# Altium project Gateway PCB.PrjPcb
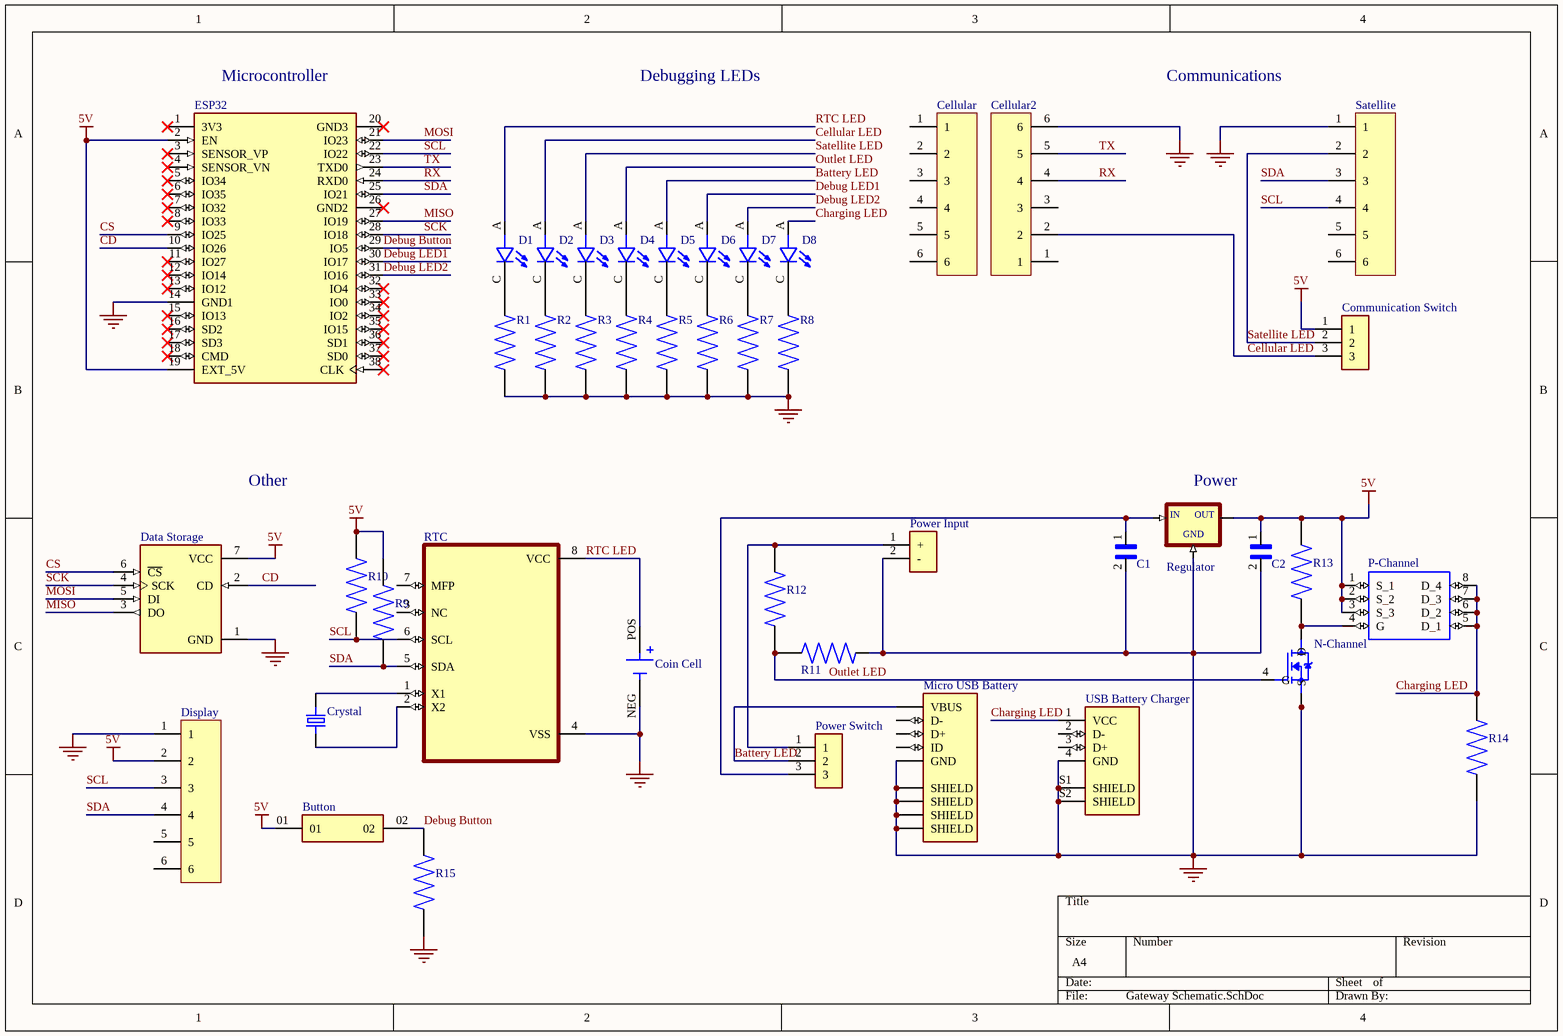
[diagram p0: Gateway Schematic.SchDoc]
1 sheet, 43 parts. Net scope: global (net labels, ports and power ports of the same name join across sheets).
Board file: Gateway Board.PcbDoc

## Sheet Gateway Schematic.SchDoc
size A4; SheetNumber: 1; SheetTotal: 1

### Parts
Button  TSW-101-23-T-D  [SAMTEC_TSW-101-23-T-D]  (value not drawn)
C1  CC0603JRX7R9BB101  [CAPC1608X90]  (value not drawn)
C2  CC0603JRX7R9BB331  [CAPC1608X90]  (value not drawn)
Cellular  1x6 Header  [Header6x2]  (value not drawn)
Cellular2  1x6 Header  [Header6x2]  (value not drawn)
Coin_Cell  BH2430T-C  [BAT_BH2430T-C]  (value not drawn)
Communication_Switch  282837-3  [TE_282837-3]  (value not drawn)
Crystal  ECS-.327-8-14X  [XTAL_ECS-.327-8-14X]  (value not drawn)
D1  SML-D12D1WT86  [LED_SML-D12D1WT86]  (value not drawn)
D2  SML-D12FWT86  [LED_SML-D12FWT86]  (value not drawn)
D3  SML-D12FWT86  [LED_SML-D12FWT86]  (value not drawn)
D4  SML-D12U1WT86  [LED_SML-D12Y1WT86]  (value not drawn)
D5  SML-D12U1WT86  [LED_SML-D12Y1WT86]  (value not drawn)
D6  SML-D12Y1WT86  [LED_SML-D12Y1WT86]  (value not drawn)
D7  SML-D12Y1WT86  [LED_SML-D12Y1WT86]  (value not drawn)
D8  SML-D12D1WT86  [LED_SML-D12D1WT86]  (value not drawn)
Data_Storage  DEV-13743  [MODULE_DEV-13743]  (value not drawn)
Display  1x6 Header  [Header6x2]  (value not drawn)
ESP32  ESP32-DEVKITC-32D  [MODULE_ESP32-DEVKITC-32D]  (value not drawn)
Micro_USB_Battery  USB3100-XX-X_REVB  [GCT_USB3100-XX-X_REVB]  (value not drawn)
N-Channel  FDS2734  [SOIC127P600X175-8N]  (value not drawn)
P-Channel  FDS6575  [SOIC127P600X175-8N]  (value not drawn)
Power_Input  282837-2  [TE_282837-2]  (value not drawn)
Power_Switch  282837-3  [TE_282837-3]  (value not drawn)
R1  RT0603BRD0743RL  [RESC1608X55N]  (value not drawn)
R2  RT0603FRE07140RL  [RESC1608X55N]  (value not drawn)
R3  RT0603FRE07140RL  [RESC1608X55N]  (value not drawn)
R4  RT0603DRE07196RL  [RESC1608X55N]  (value not drawn)
R5  RT0603FRE07140RL  [RESC1608X55N]  (value not drawn)
R6  RT0603FRE07140RL  [RESC1608X55N]  (value not drawn)
R7  RT0603FRE07140RL  [RESC1608X55N]  (value not drawn)
R8  RT0603FRE07140RL  [RESC1608X55N]  (value not drawn)
R9  RT0603FRD0711KL  [RESC1608X55N]  (value not drawn)
R10  RT0603FRD0711KL  [RESC1608X55N]  (value not drawn)
R11  RT0603FRD0711KL  [RESC1608X55N]  (value not drawn)
R12  RT0603FRD0711KL  [RESC1608X55N]  (value not drawn)
R13  RT0603FRD0711KL  [RESC1608X55N]  (value not drawn)
R14  RT0603FRD0711KL  [RESC1608X55N]  (value not drawn)
R15  RT0603FRD0711KL  [RESC1608X55N]  (value not drawn)
Regulator  L78S05CV  [TO-220-STANDING]  (value not drawn)
RTC  MCP7940M-I/P  [DIP787W46P254L927H533Q8]  (value not drawn)
Satellite  1x6 Header  [Header6x2]  (value not drawn)
USB_Battery_Charger  USB1130-15-A_REVA  [GCT_USB1130-15-A_REVA]  (value not drawn)

### Nets
5V: Button.01 C2.1 Communication_Switch.1 Data_Storage.7(VCC) Display.2 ESP32.2(EN) ESP32.19(EXT_5V) P-Channel.1(S_1) P-Channel.2(S_2) P-Channel.3(S_3) R9.2 R10.2 R13.2 Regulator.3(OUT)
GND: C1.2 C2.2 Cellular2.6 Coin_Cell.NEG Data_Storage.1(GND) Display.1 ESP32.14(GND1) Micro_USB_Battery.5(GND) Micro_USB_Battery.6(SHIELD) Micro_USB_Battery.7(SHIELD) Micro_USB_Battery.8(SHIELD) Micro_USB_Battery.9(SHIELD) N-Channel.1(S) N-Channel.2(S) N-Channel.3(S) Power_Input.2(-) R1.1 R2.1 R3.1 R4.1 R5.1 R6.1 R7.1 R8.1 R11.2 R14.1 R15.1 Regulator.2(GND) RTC.4(VSS) Satellite.1 USB_Battery_Charger.4(GND) USB_Battery_Charger.S1(SHIELD) USB_Battery_Charger.S2(SHIELD)
Battery LED: D5.A Micro_USB_Battery.1(VBUS) Power_Switch.2
CD: Data_Storage.2(CD) ESP32.10(IO26)
Cellular LED: Cellular2.2 Communication_Switch.3 D2.A
Charging LED: D8.A P-Channel.5(D_1) P-Channel.6(D_2) P-Channel.7(D_3) P-Channel.8(D_4) R14.2 USB_Battery_Charger.1(VCC)
CS: Data_Storage.6(~{CS}) ESP32.9(IO25)
Debug Button: Button.02 ESP32.29(IO5) R15.2
Debug LED1: D6.A ESP32.30(IO17)
Debug LED2: D7.A ESP32.31(IO16)
MISO: Data_Storage.3(DO) ESP32.27(IO19)
MOSI: Data_Storage.5(DI) ESP32.21(IO23)
Outlet LED: D4.A N-Channel.4(G) R11.1 R12.1
RTC LED: Coin_Cell.POS D1.A RTC.8(VCC)
RX: Cellular2.4 ESP32.24(RXD0)
Satellite LED: Communication_Switch.2 D3.A Satellite.2
SCK: Data_Storage.4(SCK) ESP32.28(IO18)
SCL: Display.3 ESP32.22(IO22) R10.1 RTC.6(SCL) Satellite.4
SDA: Display.4 ESP32.25(IO21) R9.1 RTC.5(SDA) Satellite.3
TX: Cellular2.5 ESP32.23(TXD0)
NetC1_1: C1.1 Power_Switch.3 Regulator.1(IN)
NetCrystal_1: Crystal.1 RTC.2(X2)
NetCrystal_2: Crystal.2 RTC.1(X1)
NetD1_C: D1.C R1.2
NetD2_C: D2.C R2.2
NetD3_C: D3.C R3.2
NetD4_C: D4.C R4.2
NetD5_C: D5.C R5.2
NetD6_C: D6.C R6.2
NetD7_C: D7.C R7.2
NetD8_C: D8.C R8.2
NetN-Channel_5: N-Channel.5(D) N-Channel.6(D) N-Channel.7(D) N-Channel.8(D) P-Channel.4(G) R13.1
NetPower_Input_1: Power_Input.1(+) Power_Switch.1 R12.2

Not connected (* = marked no-connect by the designer): Cellular 1 2 3 4 5 6; Cellular2 1 3; Display 5 6; ESP32 1(3V3)* 3(SENSOR_VP)* 4(SENSOR_VN)* 5(IO34)* 6(IO35)* 7(IO32)* 8(IO33)* 11(IO27)* 12(IO14)* 13(IO12)* 15(IO13)* 16(SD2)* 17(SD3)* 18(CMD)* 20(GND3)* 26(GND2)* 32(IO4)* 33(IO0)* 34(IO2)* 35(IO15)* 36(SD1)* 37(SD0)* 38(CLK)*; Micro_USB_Battery 2(D-) 3(D+) 4(ID); RTC 3(NC) 7(MFP); Satellite 5 6; USB_Battery_Charger 2(D-) 3(D+)

### Notes on the sheet
- (near ESP32) Microcontroller
- Debugging LEDs
- Communications
- Other
- (near Regulator) Power

### Library data of the parts
Button = TSW-101-23-T-D: TSW Series .100 Terminal Strip; MF: Samtec; Package: None; MP: TSW-101-23-T-D; Price: None; Availability: Bad; Value: *; SnapEDA_Link: https://www.snapeda.com/parts/TSW-101-23-T-D/Samtec/view-part/3473100/?ref=snap
C1 = CC0603JRX7R9BB101: CAP CER 100PF 50V X7R 0603; Package: None; Price: None; Value: *; MP: CC0603JRX7R9BB101; Availability: Unavailable
C2 = CC0603JRX7R9BB331: Cap Ceramic 330pF 50VDC X7R 5% SMD 0603 125Â°C Paper T/R; Package: None; Price: None; Value: *; MP: CC0603JRX7R9BB331; Availability: Unavailable
Cellular Cellular2 Display Satellite = PPTC061LFBN-RC: Female, 6 C, Straight, .100"CC; 3.20mm Tail, No Mt. 100u" Tin; PBT, Phos Bronze, 105 C; Manufacturer: Sullins; Number of Positions: 6; Pitch: 0.1inch; Supplier 1: Digi-Key; Manufacturer Part Number: PPTC061LFBN-RC; RoHS: Yes; Category: Connectors; Stock 1: 78228; Pricing 1: 1=0.52000, 10=0.44900, 80=0.37050, 440=0.32220, 1000=0.26582, 5000=0.23360, 10000=0.23270 (USD); Mount: Through Hole; Color: Black; Contact Plating: Tin; Contact Material: Bronze; Housing Material: Plastic; Package Quantity: 1000; Number of Rows: 1; Packaging: Bulk; Termination: Solder; Connector Type: Header; Contact Type: Female Socket; Length: 15.7mm; Width: 2.5mm; Height: 8.5mm; Lead Free: Lead Free; RoHS Compliant: Yes; ComponentLink1URL: https://media.digikey.com/pdf/Data%20Sheets/Sullins%20PDFs/Female_Headers.100_DS.pdf?src-supplier=Digi-Key; ComponentLink1Description: https://media.digikey.com/pdf/Data%20Sheets/Sullins%20PDFs/Female_Headers.100_DS.pdf?src-supplier=Digi-Key; ComponentLink2URL: http://www.sullinscorp.com/catalogs/78_Page80-81_HEADER_.100_2.54mm_FEMALE.pdf?src-supplier=Future+Electronics; ComponentLink2Description: http://www.sullinscorp.com/catalogs/78_Page80-81_HEADER_.100_2.54mm_FEMALE.pdf?src-supplier=Future+Electronics; Supplier Part Number 1: S7004-ND
Coin_Cell = BH2430T-C: BATTERY HOLDER COIN PC PIN 24.5mm; MF: MPD; Price: None; MP: BH2430T-C; SnapEDA_Link: https://www.snapeda.com/parts/BH2430T-C/MPD/view-part/4389108/?ref=snap; Package: None; Availability: Unavailable; Value: *
Communication_Switch Power_Switch = 282837-3: Wire to Board 3 Position 5.08 mm Pitch 30-16 AWG Euro Style Terminal Block; MF: TE Connectivity; Check_prices: https://www.snapeda.com/parts/282837-3/TE%20Connectivity%20AMP%20Connectors/view-part/2765182/?ref=eda; SnapEDA_Link: https://www.snapeda.com/parts/282837-3/TE%20Connectivity%20AMP%20Connectors/view-part/2765182/?ref=snap; Availability: Good; MP: 282837-3; Purchase-URL: https://pricing.snapeda.com/search/part/282837-3/?ref=eda; Package: None; Price: None; Value: *
Crystal = ECS-.327-8-14X: 32.768kHz Â±20ppm Crystal 8pF 40 kOhms Cylindrical Can, Radial; MF: ECS Inc.; Arrow_Electronics-Purchase-URL: https://snapeda.com/shop?store=Arrow+Electronics&id=2180365; Price: None; DigiKey-Purchase-URL: https://snapeda.com/shop?store=DigiKey&id=2180365; Package: Cylindrical Can Radial  ECS International; Availability: Good; Value: *; Mouser-Purchase-URL: https://snapeda.com/shop?store=Mouser&id=2180365; MP: ECS-.327-8-14X; SnapEDA_Link: https://www.snapeda.com/parts/ECS-.327-8-14X/ECS%20Inc./view-part/2180365/?ref=snap
D1 D8 = SML-D12D1WT86: Orange 605nm LED Indication - Discrete 2.2V 0603 (1608 Metric); MF: Rohm; Price: None; Value: *; Package: 0603 Rohm; Purchase-URL: https://pricing.snapeda.com/search/part/SML-D12D1WT86/?ref=eda; SnapEDA_Link: https://www.snapeda.com/parts/SML-D12D1WT86/Rohm/view-part/681299/?ref=snap; MP: SML-D12D1WT86; Availability: Good; Check_prices: https://www.snapeda.com/parts/SML-D12D1WT86/Rohm/view-part/681299/?ref=eda
D2 D3 = SML-D12FWT86: Green 565nm LED Indication - Discrete 2.2V 0603 (1608 Metric); MF: Rohm; Check_prices: https://www.snapeda.com/parts/SML-D12FWT86/Rohm/view-part/2753923/?ref=eda; Package: 0603 Rohm; Price: None; Value: *; MP: SML-D12FWT86; SnapEDA_Link: https://www.snapeda.com/parts/SML-D12FWT86/Rohm/view-part/2753923/?ref=snap; Availability: Good; Purchase-URL: https://pricing.snapeda.com/search/part/SML-D12FWT86/?ref=eda
D4 D5 = SML-D12U1WT86: Red 620nm LED Indication - Discrete 2.2V 0603 _1608 Metric_; MF: Rohm; Package: 0603 Rohm; Price: None; MP: SML-D12U1WT86; Availability: Unavailable; SnapEDA_Link: https://www.snapeda.com/parts/SML-D12U1WT86/Rohm/view-part/481503/?ref=snap; Value: *
D6 D7 = SML-D12Y1WT86: Yellow 590nm LED Indication - Discrete 2.2V 0603 _1608 Metric_; MF: Rohm; SnapEDA_Link: https://www.snapeda.com/parts/SML-D12Y1WT86/Rohm/view-part/617733/?ref=snap; Package: 0603 Rohm; MP: SML-D12Y1WT86; Value: *; Availability: Unavailable; Price: None
Data_Storage = DEV-13743: SPARKFUN LEVEL SHIFTING MICROSD; MF: SparkFun Electronics; SnapEDA_Link: https://www.snapeda.com/parts/DEV-13743/SparkFun%20Electronics/view-part/567676/?ref=snap; Package: None; Price: None; MP: DEV-13743; Availability: Unavailable; Value: *; Check_prices: https://www.snapeda.com/parts/DEV-13743/SparkFun%20Electronics/view-part/567676/?ref=eda
ESP32 = ESP32-DEVKITC-32D: EVAL BOARD FOR ESP-WROOM-32; MF: Espressif Systems; Value: *; MP: ESP32-DEVKITC-32D; Price: None; Check_prices: https://www.snapeda.com/parts/ESP32-DEVKITC-32D/Espressif%20Systems/view-part/2777395/?ref=eda; SnapEDA_Link: https://www.snapeda.com/parts/ESP32-DEVKITC-32D/Espressif%20Systems/view-part/2777395/?ref=snap; Availability: Warning; Purchase-URL: https://pricing.snapeda.com/search/part/ESP32-DEVKITC-32D/?ref=eda; Package: None
Micro_USB_Battery = USB3100-XX-X_REVB: USB - micro B USB 2.0 Receptacle Connector 5 Position Surface Mount, Right Angle; MF: Global Connector Technology; MP: USB3100-30-A; Value: *; Price: None; SnapEDA_Link: https://www.snapeda.com/parts/USB3100-30-A/Global%20Connector%20Technology/view-part/49207/?ref=snap; Availability: Unavailable; Package: None
N-Channel = FDS2734: N-Channel 250V 3A (Ta) 2.5W (Ta) Surface Mount 8-SOIC; MF: ON Semiconductor; Price: None; Check_prices: https://www.snapeda.com/parts/FDS2734/ON%20Semiconductor/view-part/1822193/?ref=eda; SnapEDA_Link: https://www.snapeda.com/parts/FDS2734/ON%20Semiconductor/view-part/1822193/?ref=snap; Package: SO-8 ON Semiconductor; Purchase-URL: https://pricing.snapeda.com/search/part/FDS2734/?ref=eda; Availability: Warning; MP: FDS2734; Value: *
P-Channel = FDS6575: P-Channel 20V 10A (Ta) 2.5W (Ta) Surface Mount 8-SOIC; MF: ON Semiconductor; SnapEDA_Link: https://www.snapeda.com/parts/FDS6575/ON%20Semiconductor/view-part/2754514/?ref=snap; Availability: Warning; MP: FDS6575; Price: None; Purchase-URL: https://pricing.snapeda.com/search/part/FDS6575/?ref=eda; Value: *; Check_prices: https://www.snapeda.com/parts/FDS6575/ON%20Semiconductor/view-part/2754514/?ref=eda; Package: SO-8 ON Semiconductor
Power_Input = 282837-2: Connector Terminal Blocks Receptacle 2 Position 5.08mm Solder Straight Thru-Hole 13.5A/Contact; MF: TE Connectivity; Price: None; Check_prices: https://www.snapeda.com/parts/282837-2/TE%20Connectivity%20AMP%20Connectors/view-part/2549980/?ref=eda; Package: None; Purchase-URL: https://pricing.snapeda.com/search/part/282837-2/?ref=eda; SnapEDA_Link: https://www.snapeda.com/parts/282837-2/TE%20Connectivity%20AMP%20Connectors/view-part/2549980/?ref=snap; Value: *; MP: 282837-2; Availability: Good
R1 = RT0603BRD0743RL: Res Thin Film 0603 43 Ohm 0.1% 1/10W Â±25ppm/Â°C Molded SMD SMD Paper T/R; Package: None; Price: None; Value: *; MP: RT0603BRD0743RL; Availability: Unavailable
R2 R3 R5-R8 = RT0603FRE07140RL: RES SMD 140 OHM 1% 1/10W 0603; Package: None; Price: None; Value: *; MP: RT0603FRE07140RL; Availability: Unavailable
R4 = RT0603DRE07196RL: RES SMD 196 OHM 0.5% 1/10W 0603; Package: None; Price: None; Value: *; MP: RT0603DRE07196RL; Availability: Unavailable
R9-R15 = RT0603FRD0711KL: RES SMD 11K OHM 1% 1/10W 0603; Package: None; Price: None; Value: *; MP: RT0603FRD0711KL; Availability: Unavailable
Regulator = L78S05CV: Linear Voltage Regulator IC 1 Output 2A TO-220AB; MF: STMicroelectronics; Value: *; Availability: Unavailable; Package: TO-220 STMicroelectronics; Price: None; SnapEDA_Link: https://www.snapeda.com/parts/L78S05CV/STMicroelectronics/view-part/8089/?ref=snap; MP: L78S05CV
RTC = MCP7940M-I/P: Real Time Clock (RTC) IC Clock/Calendar 64B IÂ²C, 2-Wire Serial 8-DIP (0.300, 7.62mm); MF: Microchip; Value: *; SnapEDA_Link: https://www.snapeda.com/parts/MCP7940M-I/P/Microchip/view-part/?ref=snap; MP: MCP7940M-I/P; Purchase-URL: https://pricing.snapeda.com/search/part/MCP7940M-I/P/?ref=eda; Check_prices: https://www.snapeda.com/parts/MCP7940M-I/P/Microchip/view-part/?ref=eda; Availability: In Stock; Price: None; Package: DIP-8 Microchip
USB_Battery_Charger = USB1130-15-A_REVA: MF: Global Connector Technology; SnapEDA_Link: https://www.snapeda.com/parts/USB1130-15-A/Global%20Connector%20Technology/view-part/5160678/?ref=snap; Package: None; Check_prices: https://www.snapeda.com/parts/USB1130-15-A/Global%20Connector%20Technology/view-part/5160678/?ref=eda; MP: USB1130-15-A; Value: *; Availability: Unavailable; Price: None